# EAGLE design 1750_master_remote (EAGLE 7.7.0)
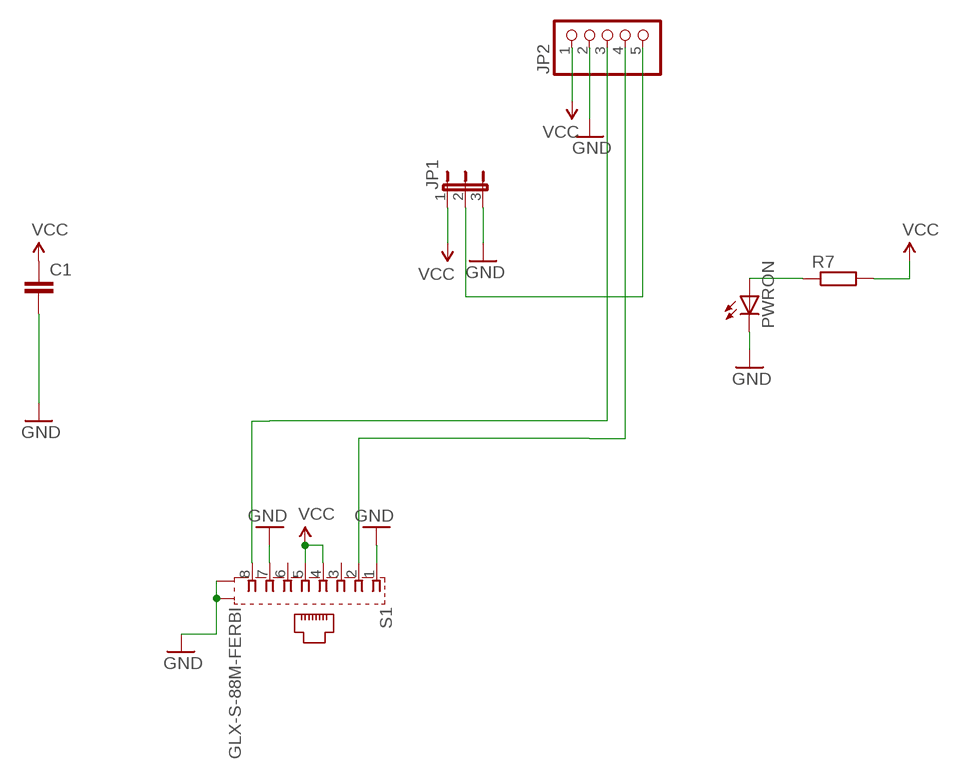
[diagram p0: schematic, sheet 1]

## Parts
C1  C-EU025-025X050  [C025-025X050]
JP1  JP2E  [JP2]
JP2  PINHD-1X5  [1X05]
PWRON  LED5MM  [LED5MM]
R7  R-EU_0207/10  [0207/10]
S1  GLX-S-88M-FERBI  [GLX-S-88M-FERBI]

## Nets
ADDR: JP1.2 JP2.5
GND: C1.2 JP1.3 JP2.2 PWRON.K(C) S1.1 S1.7 S1.S1 S1.S2
N$19: PWRON.A R7.1
SCL: JP2.3 S1.8
SDA: JP2.4 S1.2
VCC: C1.1 JP1.1 JP2.1 R7.2 S1.4 S1.5
Unconnected: S1.3 S1.6

## Library data of the parts
C1 = resistor:C-EU: CAPACITOR, European symbol
JP1 = jumper:JP2E: JUMPER
JP2 = pinhead:PINHD-1X5: PIN HEADER
PWRON = led:LED: LED OSRAM: - CHIPLED LG R971, LG N971, LY N971, LG Q971, LY Q971, LO R971, LY R971 LH N974, LH R974 LS Q976, LO Q976, LY Q976 LO Q996 - Hyper CHIPLED LW Q18S LB Q993, LB Q99A, LB R99A - SideLED LS A670, LO A670, LY A670, LG A670, LP A670 LB A673, LV A673, LT A673, LW A673 LH A674 LY A675 LS A676, LA A676, LO A676, LY A676, LW A676 LS A679, LY A679, LG A679 - Hyper Micro SIDELED® LS Y876, LA Y876, LO Y876, LY Y876 LT Y87S - SmartLED LW L88C, LW L88S LB L89C, LB L89S, LG L890 LS L89K, LO L89K, LY L89K LS L896, LA L896, LO L896, LY L896 - TOPLED LS T670, LO T670, LY T670, LG T670, LP T670 LSG T670, LSP T670, LSY T670, LOP T670, LYG T670 LG T671, LOG T671, LSG T671 LB T673, LV T673, LT T673, LW T673 LH T674 LS T676, LA T676, LO T676, LY T676, LB T676, LH T676, LSB T676, LW T676 LB T67C, LV T67C, LT T67C, LS T67K, LO T67K, LY T67K, LW E67C LS E67B, LA E67B, LO E67B, LY E67B, LB E67C, LV E67C, LT E67C LW T67C LS T679, LY T679, LG T679 LS T770, LO T770, LY T770, LG T770, LP T770 LB T773, LV T773, LT T773, LW T773 LH T774 LS E675, LA E675, LY E675, LS T675 LS T776, LA T776, LO T776, LY T776, LB T776 LHGB T686 LT T68C, LB T68C - Hyper Mini TOPLED® LB M676 - Mini TOPLED Santana® LG M470 LS M47K, LO M47K, LY M47K Source: http://www.osram.convergy.de LUXEON: - LUMILED® LXK2-PW12-R00, LXK2-PW12-S00, LXK2-PW14-U00, LXK2-PW14-V00 LXK2-PM12-R00, LXK2-PM12-S00, LXK2-PM14-U00 LXK2-PE12-Q00, LXK2-PE12-R00, LXK2-PE12-S00, LXK2-PE14-T00, LXK2-PE14-U00 LXK2-PB12-K00, LXK2-PB12-L00, LXK2-PB12-M00, LXK2-PB14-N00, LXK2-PB14-P00, LXK2-PB14-Q00 LXK2-PR12-L00, LXK2-PR12-M00, LXK2-PR14-Q00, LXK2-PR14-R00 LXK2-PD12-Q00, LXK2-PD12-R00, LXK2-PD12-S00 LXK2-PH12-R00, LXK2-PH12-S00 LXK2-PL12-P00, LXK2-PL12-Q00, LXK2-PL12-R00 Source: www.luxeon.com KINGBRIGHT: KA-3528ASYC Source: www.kingbright.com
R7 = resistor:R-EU_: RESISTOR, European symbol
S1 = con-kycon:GLX-S-88M-FERBI: Mod. Jack, Right Angle, 8 posiotion, 8 contatcs RJ45 Source: GLX-S-88M.pdf

## Board
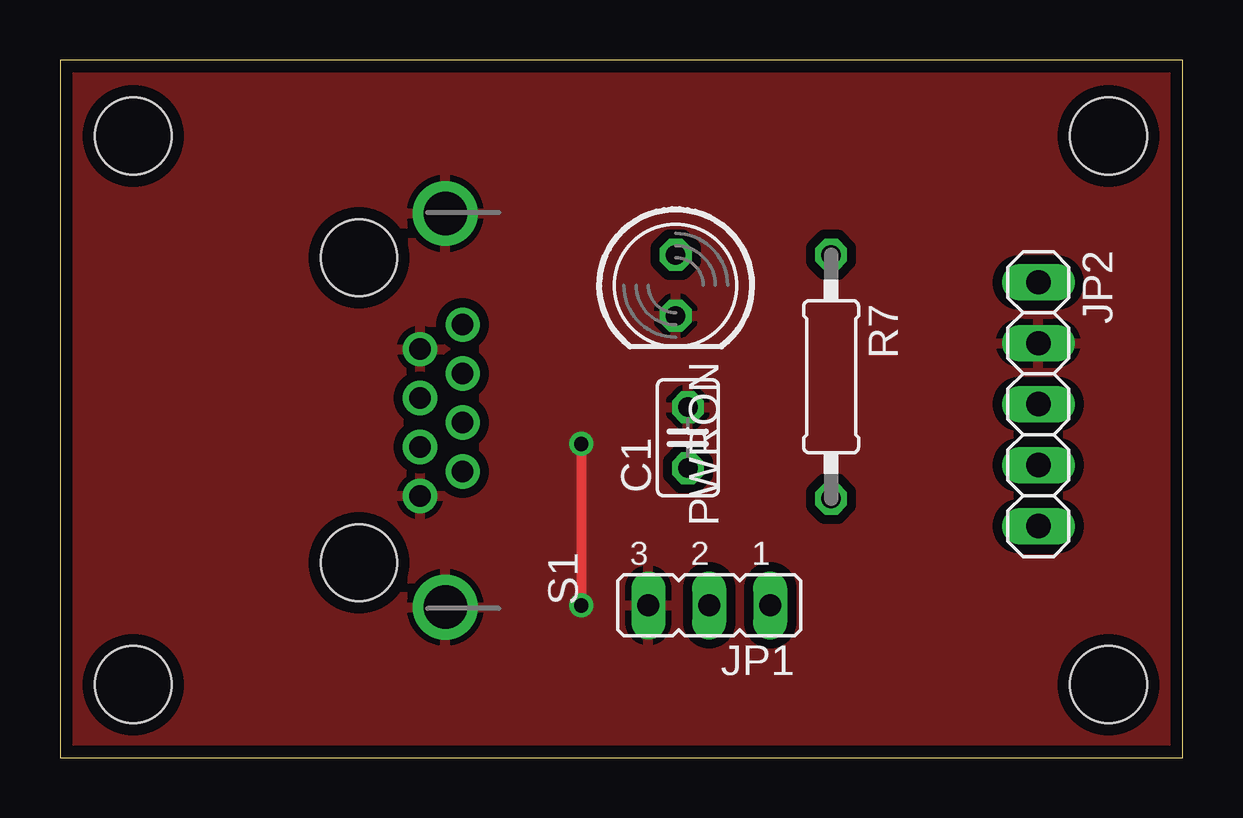
[diagram p1: board, top side]
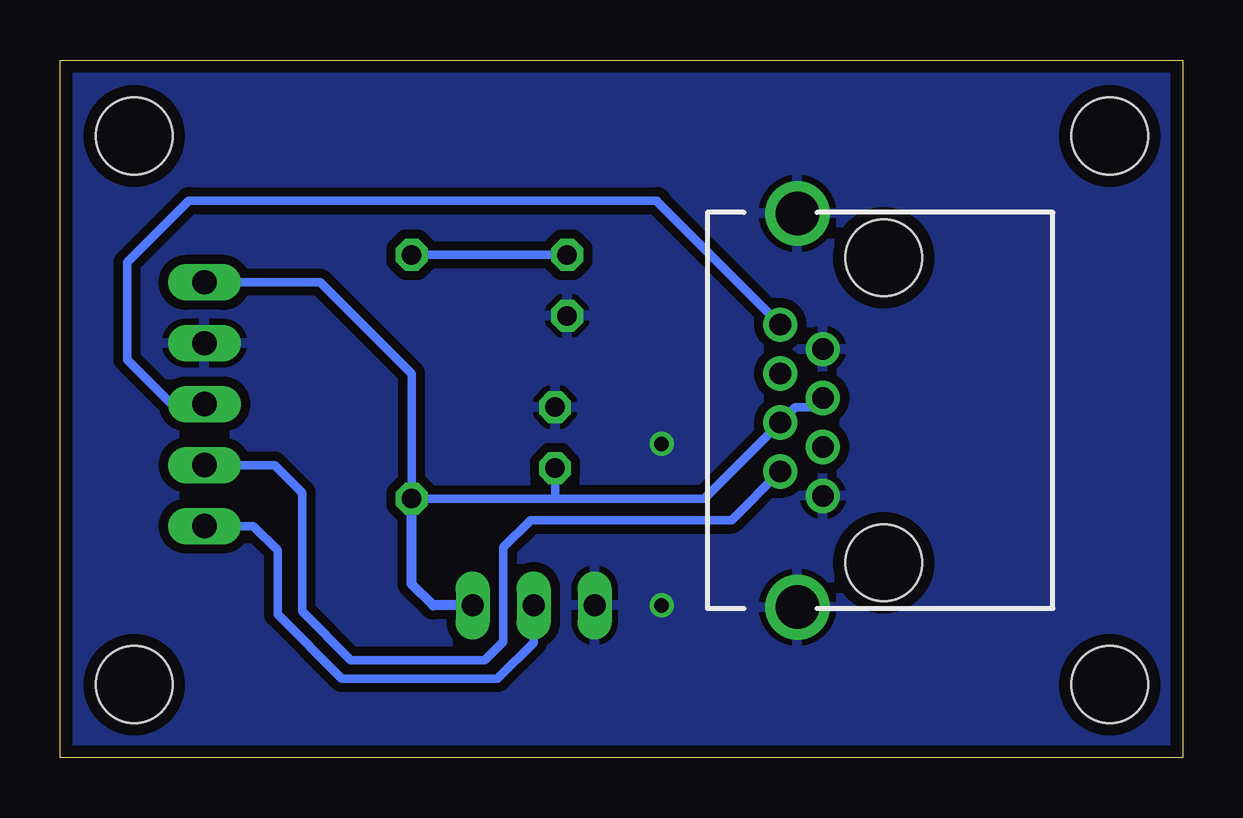
[diagram p2: board, bottom side, seen from below]

Size 46.79 x 29.07 mm. Coordinates in mm from the lower left corner, seen from the top.
Outline: 0,0 46.79,0 46.79,29.07 0,29.07 0,0
Copper layers (1*16): Top 0.035mm / dielectric 1.5mm / Bottom 0.035mm
Design rules "ff": minimum track width 14mil, minimum drill 24mil, track to track 15mil, track to pad 15mil, pad to pad 8mil, via to via 8mil, smd to smd 8mil, copper to edge 20mil, drill to drill 8mil, minimum pad ring 10mil, minimum via ring 8mil, stop-mask expansion 4mil, vias tented up to drill 0mil, thermal gap 10mil
Holes 3.2 mm at 3.05,25.91 43.69,25.91 43.69,3.05 3.05,3.05

### Footprints (pad centres in the part's own frame; a part is rotated, then mirrored left to right if it is on the bottom)
C025-025X050 = drill 0.813 octagon: 1 -1.27,0; 2 1.27,0
JP2 = drill 0.914 long: 1 -2.54,0; 2 0,0; 3 2.54,0
1X05 = drill 1.016 long: 1 -5.08,0; 2 -2.54,0; 3 0,0; 4 2.54,0; 5 5.08,0
LED5MM = drill 0.813 octagon: A -1.27,0; K 1.27,0
0207/10 = drill 0.813 octagon: 1 -5.08,0; 2 5.08,0
GLX-S-88M-FERBI = drill 0.9 pad 1.422: 1 -3.57,-3.062; 2 -2.55,-4.84; 3 -1.53,-3.062; 4 -0.51,-4.84; 5 0.51,-3.062; 6 1.53,-4.84; 7 2.55,-3.062; 8 3.57,-4.84 | drill 1.803 pad 2.54: S1 -8.2,-4.12; S2 8.2,-4.12 | hole 3.185: -6.35,-0.52; 6.35,-0.52

### Placement (x,y rotation side)
C1  26.16,13.34 90 top
JP1  27.05,6.35 180 top
JP2  40.77,14.73 270 top
PWRON  25.65,19.68 270 top
R7  32.13,15.88 270 top
S1  11.94,14.48 90 top

### Tracks (layer width: path | path; a pad name or v marks a point on that pad's centre or on a via)
ADDR
  Bottom 0.356: JP1.2 27.05,6.27 27.05,4.8 28.52,3.33 28.55,3.3 35.05,3.3 37.72,5.97 37.72,8.64 38.73,9.65 JP2.5 40.68,9.59
GND  (via drill 0.6)
  Top 0.406: v21.72,13.08 v21.72,6.35
  pour Bottom: 0.51,28.45 46.23,28.45 46.23,0.51 0.51,0.51
  pour Top: 0.51,28.45 46.23,28.45 46.23,0.51 0.51,0.51
N$19
  Bottom 0.356: R7.1 PWRON.A
SCL
  Bottom 0.356: JP2.3 41.05,14.75 42.15,14.75 43.99,16.59 43.99,20.64 41.42,23.22 21.89,23.22 21.89,23.16 S1.8
SDA
  Bottom 0.356: JP2.4 37.85,12.19 36.7,11.05 36.7,6.1 34.67,4.06 29.08,4.06 28.32,4.83 28.32,8.76 27.18,9.91 18.8,9.91 S1.2
VCC
  Bottom 0.356: 26.16,10.79 22.1,10.79 19.95,10.79 S1.4 16.74,14.01 16.14,14.61 15.38,14.61 S1.5 | 26.16,10.79 C1.1 | 26.16,10.79 31.62,10.79 R7.2 32.13,16 35.94,19.81 JP2.1
  Bottom 0.406: JP1.1 31.24,6.35 32.13,7.24 R7.2